# EAGLE schematic gates_and_flops (EAGLE 9.2.0)

## Sheet 1 of 3
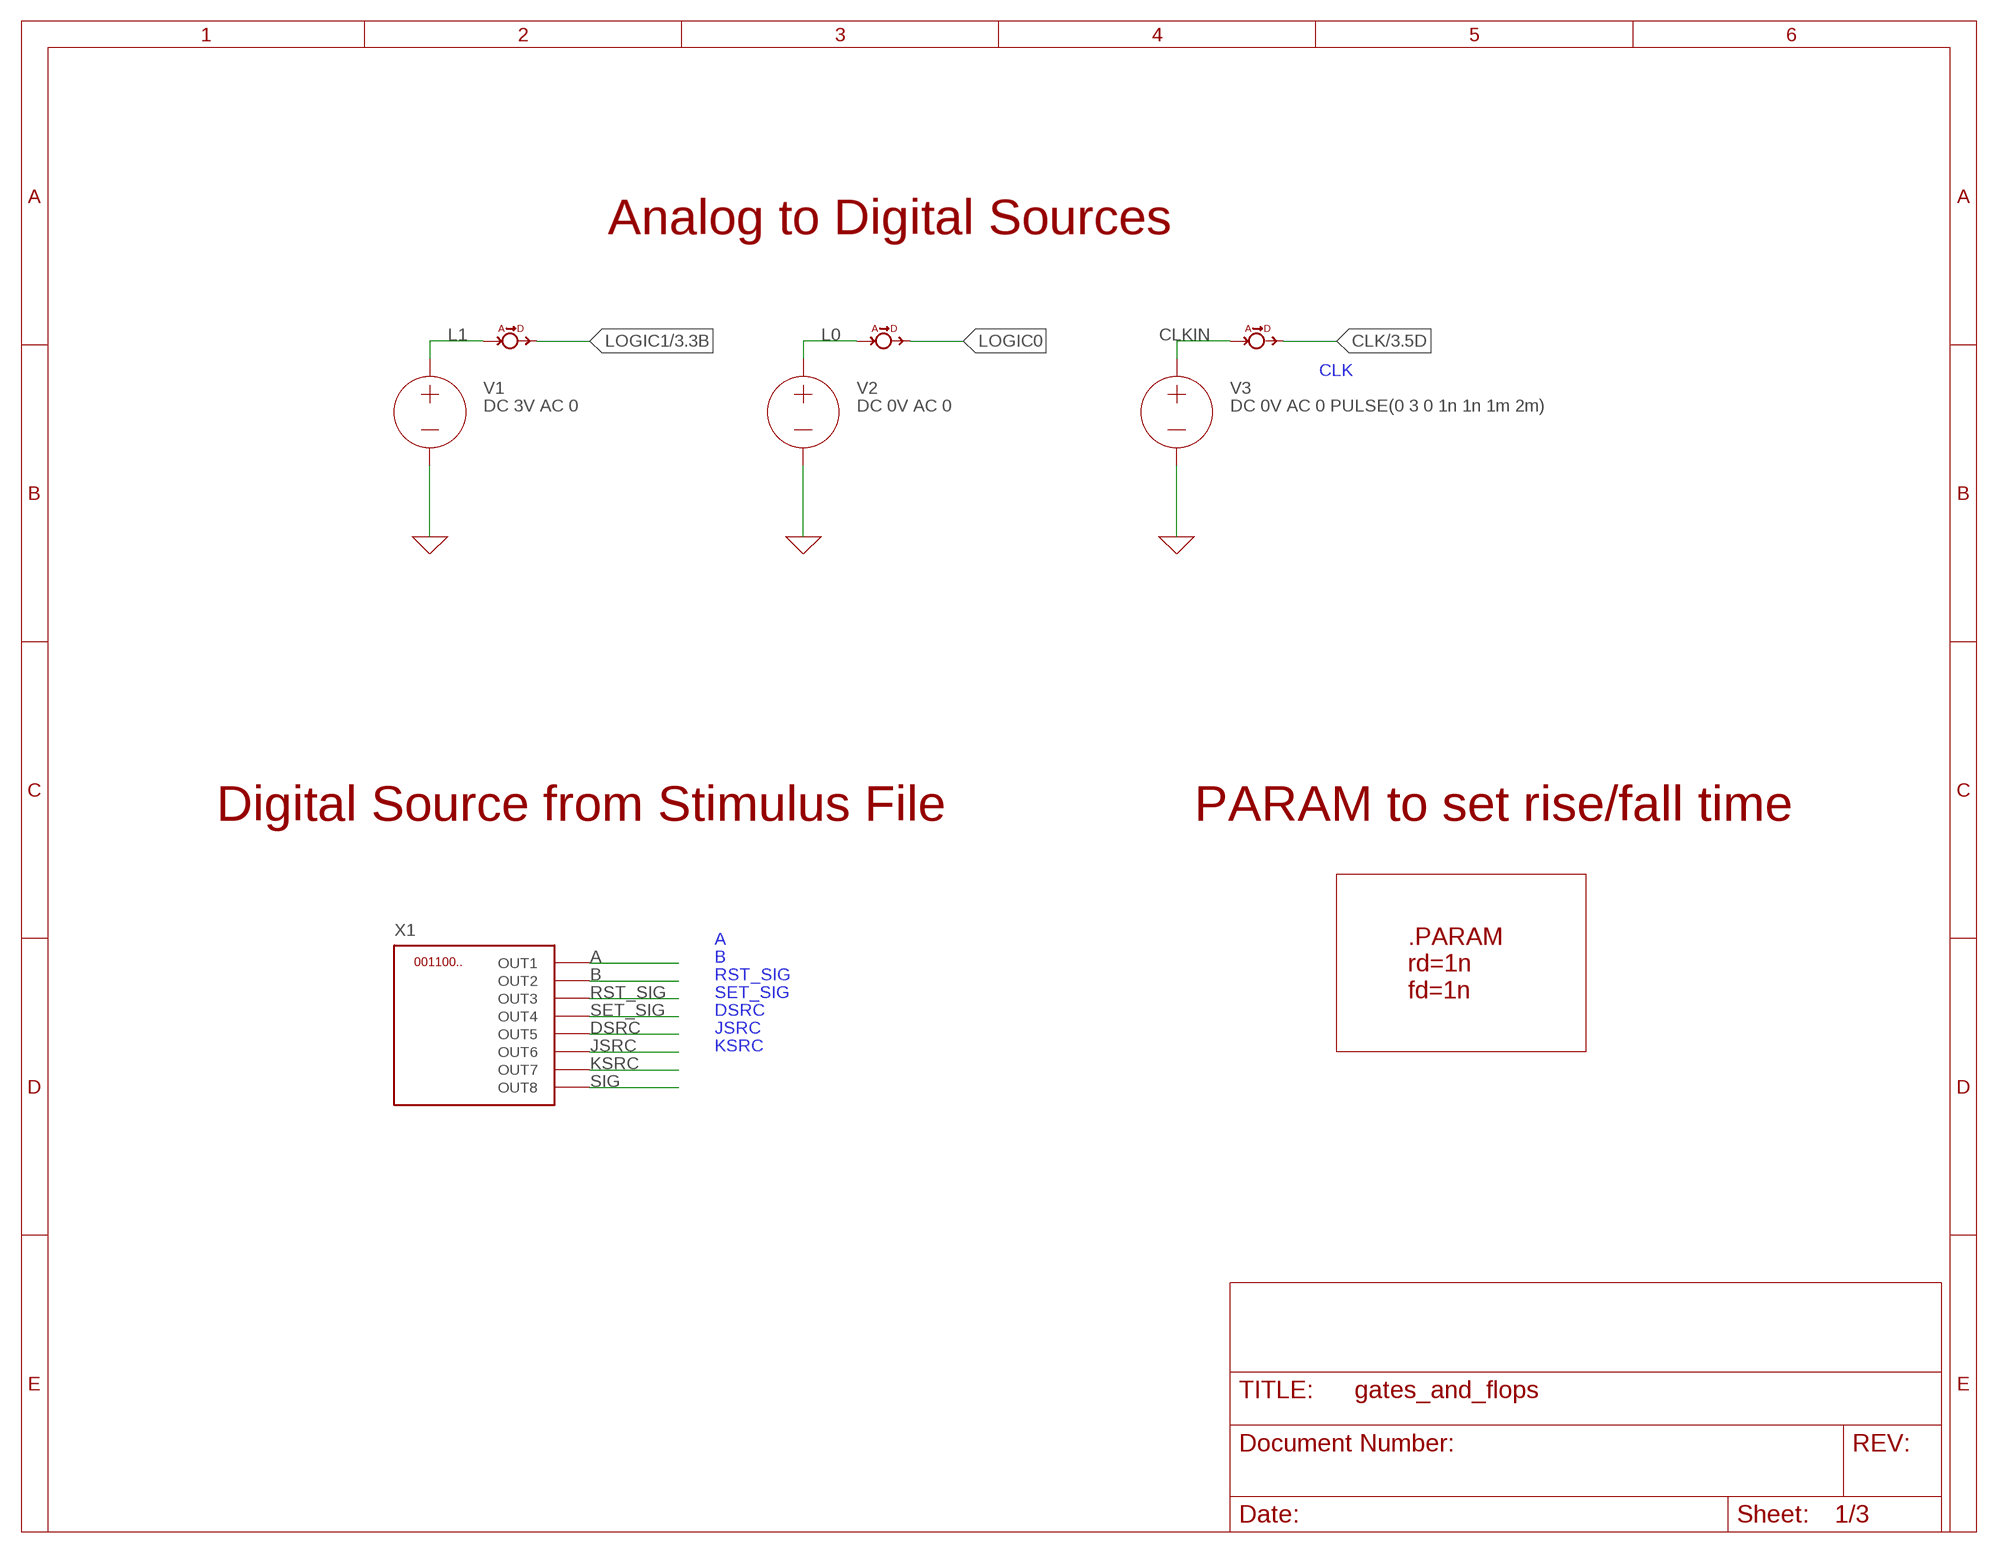
[diagram p0: schematic, sheet 1]

### Parts
V1  DC 3V AC 0  VOLTAGE  (no package)
V2  DC 0V AC 0  VOLTAGE  (no package)
V3  DC 0V AC 0 PULSE(0 3 0 1n 1n 1m 2m)  VOLTAGE  (no package)
X1  DIGSRC8  (no package)
X14  ATODB  (no package)
X15  ATODB  (no package)
X16  ATODB  (no package)

### Nets
0: V1.- V2.- V3.- ; supply symbol labelled GND
A: X1.OUT1 ; also sheet 2
B: X1.OUT2 ; also sheet 2
CLK: X16.DIG ; also sheet 3
CLKIN: V3.+ X16.AN
DSRC: X1.OUT5 ; also sheet 3
JSRC: X1.OUT6 ; also sheet 3
KSRC: X1.OUT7 ; also sheet 3
L0: V2.+ X15.AN
L1: V1.+ X14.AN
LOGIC0: X15.DIG
LOGIC1: X14.DIG ; also sheet 3
RST_SIG: X1.OUT3 ; also sheet 3
SET_SIG: X1.OUT4 ; also sheet 3
SIG: X1.OUT8

### Notes on the sheet
- Analog to Digital Sources
- Digital Source from Stimulus File | PARAM to set rise/fall time
- .PARAM
  rd=1n
  fd=1n

## Sheet 2 of 3
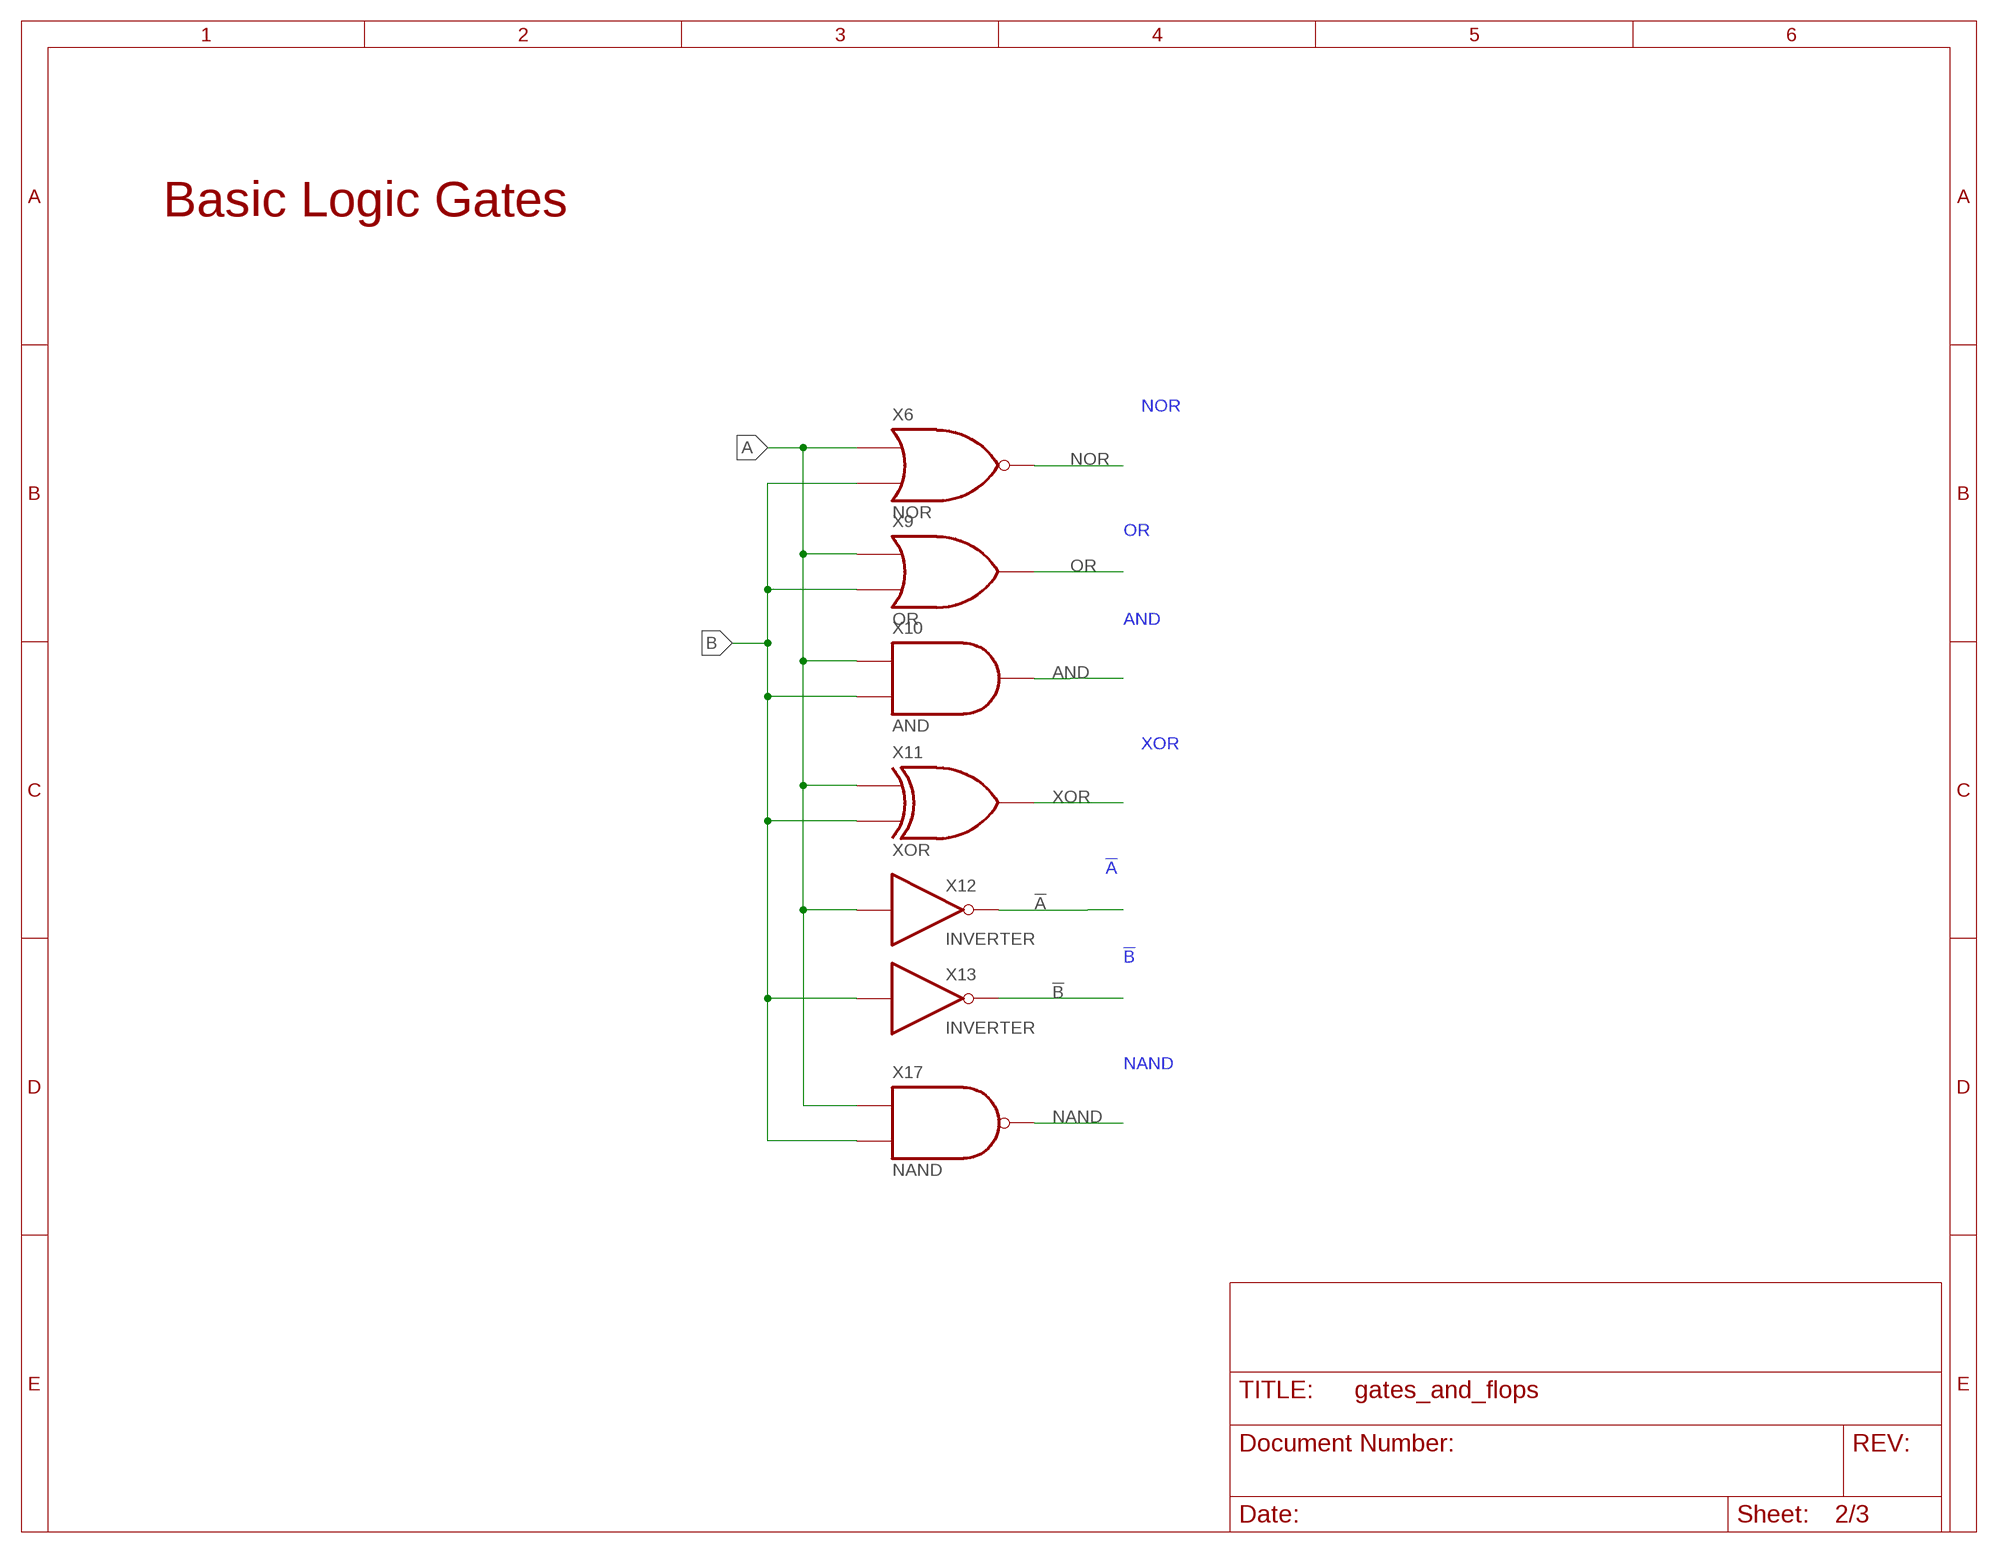
[diagram p1: schematic, sheet 2]

### Parts
X6  NOR  (no package)
X9  OR  (no package)
X10  AND  (no package)
X11  XOR  (no package)
X12  INVERTER  (no package)
X13  INVERTER  (no package)
X17  NAND  (no package)

### Nets
!A: X12.O
!B: X13.O
A: X6.A X9.A X10.A X11.A X12.I X17.A ; also sheet 1
AND: X10.Y
B: X6.B X9.B X10.B X11.B X13.I X17.B ; also sheet 1
NAND: X17.Y
NOR: X6.Y
OR: X9.Y
XOR: X11.Y

### Notes on the sheet
- Basic Logic Gates

## Sheet 3 of 3
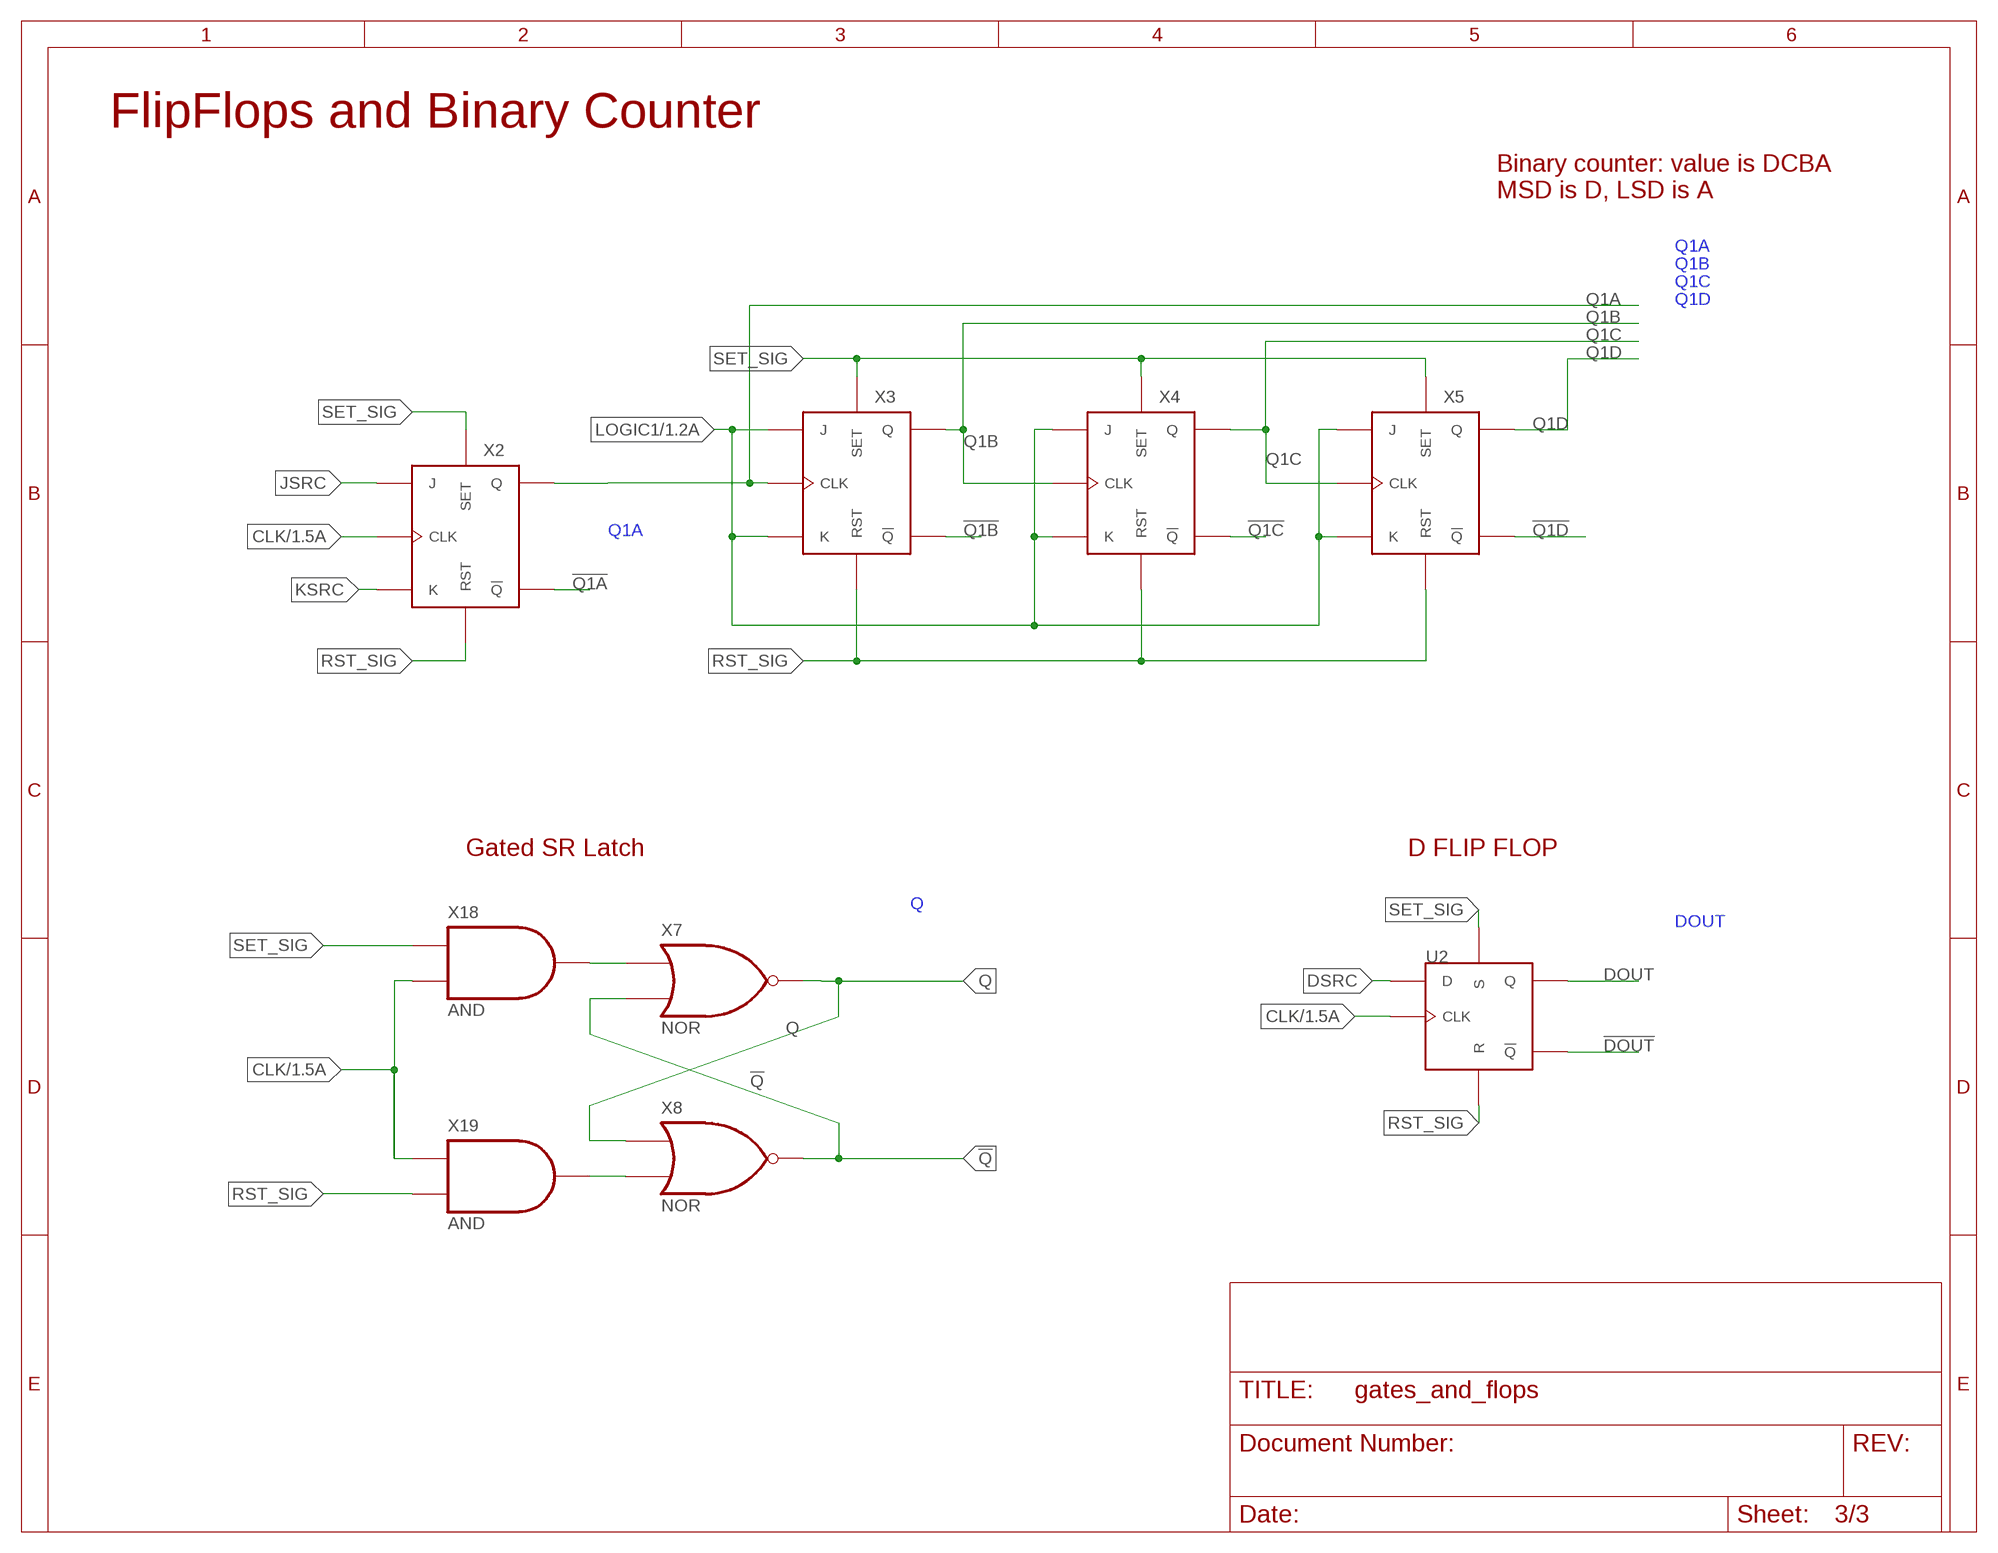
[diagram p2: schematic, sheet 3]

### Parts
U2  DFF  (no package)
X2  JKFF  (no package)
X3  JKFF  (no package)
X4  JKFF  (no package)
X5  JKFF  (no package)
X7  NOR  (no package)
X8  NOR  (no package)
X18  AND  (no package)
X19  AND  (no package)

### Nets
!DOUT: U2.!Q
!Q: X7.B X8.Y
!Q1A: X2.!Q
!Q1B: X3.!Q
!Q1C: X4.!Q
!Q1D: X5.!Q
CLK: U2.CLK X2.CLK X18.B X19.A ; also sheet 1
DOUT: U2.Q
DSRC: U2.D ; also sheet 1
JSRC: X2.J ; also sheet 1
KSRC: X2.K ; also sheet 1
LOGIC1: X3.J X3.K X4.J X4.K X5.J X5.K ; also sheet 1
N$2: X7.A X18.Y
N$3: X8.B X19.Y
Q: X7.Y X8.A
Q1A: X2.Q X3.CLK
Q1B: X3.Q X4.CLK
Q1C: X4.Q X5.CLK
Q1D: X5.Q
RST_SIG: U2.R X2.RST X3.RST X4.RST X5.RST X19.B ; also sheet 1
SET_SIG: U2.S X2.SET X3.SET X4.SET X5.SET X18.A ; also sheet 1

### Notes on the sheet
- FlipFlops and Binary Counter
- Binary counter: value is DCBA 
  MSD is D, LSD is A
- Gated SR Latch | D FLIP FLOP

## Library data of the parts
U2 = ngspice-digital:DFF: D TYPE FLIP FLOP
V1-V3 = ngspice-simulation:VOLTAGE: Independent Voltage Source, either DC, AC, PULSE, SINE, PWL, EXP, or SFFM; VALUE: 0V
X1 = ngspice-digital:DIGSRC8: 8 output digital (file) source; EAGLE_DIGITAL_SOURCE_FILE: driverd81.dsource.txt; SPICEMODEL: DRIVERD81; SPICEPREFIX: X
X2-X5 = ngspice-digital:JKFF: JK TYPE FLIP FLOP
X6-X8 = ngspice-digital:NOR: 2 input NOR Gate
X9 = ngspice-digital:OR: 2 input logic OR gate
X10 X18 X19 = ngspice-digital:AND: 2 input logic AND gate
X11 = ngspice-digital:XOR: 2 input XOR gate
X12 X13 = ngspice-digital:INVERTER: logic inverter (NOT gate)
X14-X16 = ngspice-digital:ATODB: Analog to digital bridge
X17 = ngspice-digital:NAND: 2 input NAND gate